# Altium schematic sheet PressurePulse_Brain-PCB_Master.SchDoc
size B; SheetNumber: 1; SheetTotal: 17
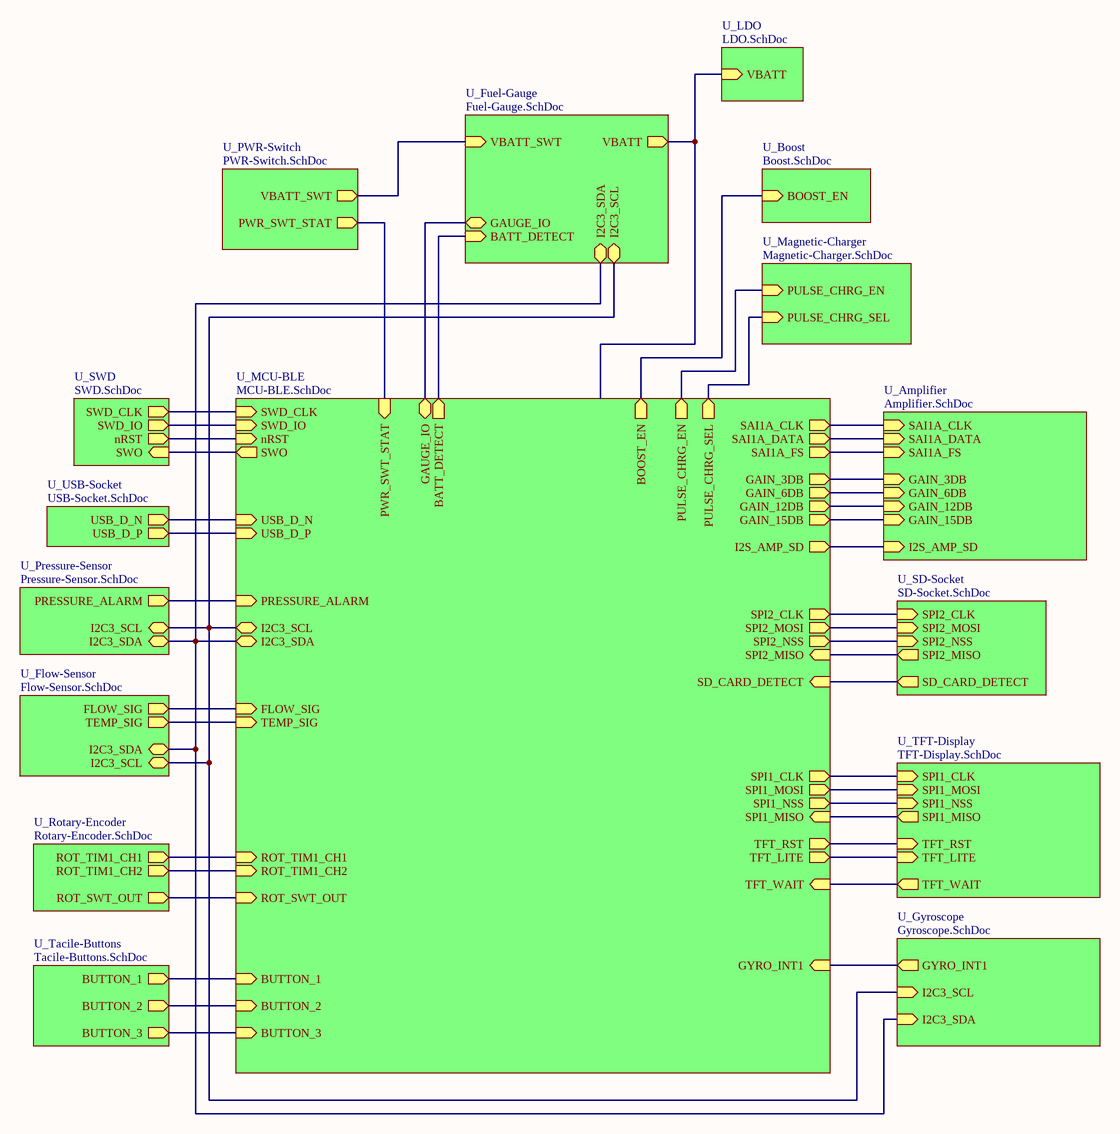
[diagram p0: PressurePulse_Brain-PCB_Master.SchDoc]

## Sub-sheets
U_Amplifier = Amplifier.SchDoc: SAI1A_DATA (in), SAI1A_FS (in), SAI1A_CLK (in), GAIN_3DB (in), GAIN_6DB (in), GAIN_12DB (in), GAIN_15DB (in), I2S_AMP_SD (in)
U_Boost = Boost.SchDoc: BOOST_EN (in)
U_Flow-Sensor = Flow-Sensor.SchDoc: FLOW_SIG (out), TEMP_SIG (out), I2C3_SCL (bidir), I2C3_SDA (bidir)
U_Fuel-Gauge = Fuel-Gauge.SchDoc: I2C3_SCL (bidir), I2C3_SDA (bidir), GAUGE_IO (bidir), BATT_DETECT (in), VBATT_SWT (in), VBATT (out)
U_Gyroscope = Gyroscope.SchDoc: I2C3_SDA (in), GYRO_INT1 (out), I2C3_SCL (in)
U_LDO = LDO.SchDoc: VBATT (in)
U_Magnetic-Charger = Magnetic-Charger.SchDoc: PULSE_CHRG_EN (in), PULSE_CHRG_SEL (in)
U_MCU-BLE = MCU-BLE.SchDoc: SWO (out), SWD_CLK (in), SWD_IO (in), nRST (in), USB_D_N (in), USB_D_P (in), I2C3_SCL (bidir), I2C3_SDA (bidir), SAI1A_DATA (out), SAI1A_CLK (out), SAI1A_FS (out), SPI1_NSS (out), SPI1_CLK (out), SPI1_MISO (in), SPI1_MOSI (out), SPI2_NSS (out), SPI2_MISO (in), SPI2_MOSI (out), FLOW_SIG (in), TEMP_SIG (in), TFT_LITE (out), SPI2_CLK (out), TFT_WAIT (in), TFT_RST (out), BUTTON_1 (in), BUTTON_2 (in), BUTTON_3 (in), PULSE_CHRG_EN (out), SD_CARD_DETECT (in), GAIN_3DB (out), GAIN_6DB (out), GAIN_12DB (out), GAIN_15DB (out), ROT_SWT_OUT (in), PWR_SWT_STAT (in), GAUGE_IO (bidir), BATT_DETECT (out), I2S_AMP_SD (out), ROT_TIM1_CH1 (in), ROT_TIM1_CH2 (in), BOOST_EN (out), PRESSURE_ALARM (in), GYRO_INT1 (in), PULSE_CHRG_SEL (out)
U_Pressure-Sensor = Pressure-Sensor.SchDoc: I2C3_SDA (bidir), I2C3_SCL (bidir), PRESSURE_ALARM (out)
U_PWR-Switch = PWR-Switch.SchDoc: PWR_SWT_STAT (out), VBATT_SWT (out)
U_Rotary-Encoder = Rotary-Encoder.SchDoc: ROT_SWT_OUT (out), ROT_TIM1_CH1 (out), ROT_TIM1_CH2 (out)
U_SD-Socket = SD-Socket.SchDoc: SPI2_CLK (in), SPI2_MOSI (in), SD_CARD_DETECT (out), SPI2_NSS (in), SPI2_MISO (out)
U_SWD = SWD.SchDoc: nRST (out), SWD_IO (out), SWD_CLK (out), SWO (in)
U_Tacile-Buttons = Tacile-Buttons.SchDoc: BUTTON_1 (out), BUTTON_3 (out), BUTTON_2 (out)
U_TFT-Display = TFT-Display.SchDoc: TFT_LITE (in), SPI1_CLK (in), SPI1_MISO (out), SPI1_MOSI (in), SPI1_NSS (in), TFT_RST (in), TFT_WAIT (out)
U_USB-Socket = USB-Socket.SchDoc: USB_D_N (out), USB_D_P (out)

## Nets
(unnamed): sheet U_MCU-BLE/SWO, sheet U_SWD/SWO
(unnamed): sheet U_MCU-BLE/SWD_CLK, sheet U_SWD/SWD_CLK
(unnamed): sheet U_MCU-BLE/SWD_IO, sheet U_SWD/SWD_IO
(unnamed): sheet U_MCU-BLE/nRST, sheet U_SWD/nRST
(unnamed): sheet U_MCU-BLE/USB_D_N, sheet U_USB-Socket/USB_D_N
(unnamed): sheet U_MCU-BLE/USB_D_P, sheet U_USB-Socket/USB_D_P
(unnamed): sheet U_MCU-BLE/I2C3_SCL, sheet U_Pressure-Sensor/I2C3_SCL, sheet U_Flow-Sensor/I2C3_SCL, sheet U_Fuel-Gauge/I2C3_SCL, sheet U_Gyroscope/I2C3_SCL
(unnamed): sheet U_MCU-BLE/I2C3_SDA, sheet U_Pressure-Sensor/I2C3_SDA, sheet U_Flow-Sensor/I2C3_SDA, sheet U_Fuel-Gauge/I2C3_SDA, sheet U_Gyroscope/I2C3_SDA
(unnamed): sheet U_MCU-BLE/SAI1A_DATA, sheet U_Amplifier/SAI1A_DATA
(unnamed): sheet U_MCU-BLE/SAI1A_CLK, sheet U_Amplifier/SAI1A_CLK
(unnamed): sheet U_MCU-BLE/SAI1A_FS, sheet U_Amplifier/SAI1A_FS
(unnamed): sheet U_MCU-BLE/SPI1_NSS, sheet U_TFT-Display/SPI1_NSS
(unnamed): sheet U_MCU-BLE/SPI1_CLK, sheet U_TFT-Display/SPI1_CLK
(unnamed): sheet U_MCU-BLE/SPI1_MISO, sheet U_TFT-Display/SPI1_MISO
(unnamed): sheet U_MCU-BLE/SPI1_MOSI, sheet U_TFT-Display/SPI1_MOSI
(unnamed): sheet U_MCU-BLE/SPI2_NSS, sheet U_SD-Socket/SPI2_NSS
(unnamed): sheet U_MCU-BLE/SPI2_MISO, sheet U_SD-Socket/SPI2_MISO
(unnamed): sheet U_MCU-BLE/SPI2_MOSI, sheet U_SD-Socket/SPI2_MOSI
(unnamed): sheet U_MCU-BLE/FLOW_SIG, sheet U_Flow-Sensor/FLOW_SIG
(unnamed): sheet U_MCU-BLE/TEMP_SIG, sheet U_Flow-Sensor/TEMP_SIG
(unnamed): sheet U_MCU-BLE/TFT_LITE, sheet U_TFT-Display/TFT_LITE
(unnamed): sheet U_MCU-BLE/SPI2_CLK, sheet U_SD-Socket/SPI2_CLK
(unnamed): sheet U_MCU-BLE/TFT_WAIT, sheet U_TFT-Display/TFT_WAIT
(unnamed): sheet U_MCU-BLE/TFT_RST, sheet U_TFT-Display/TFT_RST
(unnamed): sheet U_MCU-BLE/BUTTON_1, sheet U_Tacile-Buttons/BUTTON_1
(unnamed): sheet U_MCU-BLE/BUTTON_2, sheet U_Tacile-Buttons/BUTTON_2
(unnamed): sheet U_MCU-BLE/BUTTON_3, sheet U_Tacile-Buttons/BUTTON_3
(unnamed): sheet U_MCU-BLE/PULSE_CHRG_EN, sheet U_Magnetic-Charger/PULSE_CHRG_EN
(unnamed): sheet U_MCU-BLE/SD_CARD_DETECT, sheet U_SD-Socket/SD_CARD_DETECT
(unnamed): sheet U_MCU-BLE/GAIN_3DB, sheet U_Amplifier/GAIN_3DB
(unnamed): sheet U_MCU-BLE/GAIN_6DB, sheet U_Amplifier/GAIN_6DB
(unnamed): sheet U_MCU-BLE/GAIN_12DB, sheet U_Amplifier/GAIN_12DB
(unnamed): sheet U_MCU-BLE/GAIN_15DB, sheet U_Amplifier/GAIN_15DB
(unnamed): sheet U_MCU-BLE/ROT_SWT_OUT, sheet U_Rotary-Encoder/ROT_SWT_OUT
(unnamed): sheet U_MCU-BLE/PWR_SWT_STAT, sheet U_PWR-Switch/PWR_SWT_STAT
(unnamed): sheet U_MCU-BLE/GAUGE_IO, sheet U_Fuel-Gauge/GAUGE_IO
(unnamed): sheet U_MCU-BLE/BATT_DETECT, sheet U_Fuel-Gauge/BATT_DETECT
(unnamed): sheet U_MCU-BLE/I2S_AMP_SD, sheet U_Amplifier/I2S_AMP_SD
(unnamed): sheet U_MCU-BLE/ROT_TIM1_CH1, sheet U_Rotary-Encoder/ROT_TIM1_CH1
(unnamed): sheet U_MCU-BLE/ROT_TIM1_CH2, sheet U_Rotary-Encoder/ROT_TIM1_CH2
(unnamed): sheet U_MCU-BLE/BOOST_EN, sheet U_Boost/BOOST_EN
(unnamed): sheet U_MCU-BLE/PRESSURE_ALARM, sheet U_Pressure-Sensor/PRESSURE_ALARM
(unnamed): sheet U_MCU-BLE/GYRO_INT1, sheet U_Gyroscope/GYRO_INT1
(unnamed): sheet U_MCU-BLE/PULSE_CHRG_SEL, sheet U_Magnetic-Charger/PULSE_CHRG_SEL
(unnamed): sheet U_PWR-Switch/VBATT_SWT, sheet U_Fuel-Gauge/VBATT_SWT
(unnamed): sheet U_Fuel-Gauge/VBATT, sheet U_LDO/VBATT